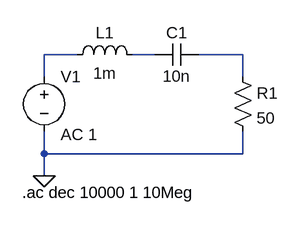
[diagram p0: schematic Circuito6.asc]
Circuito6.asc, the LTspice schematic file:
Version 4
SHEET 1 880 680
WIRE 48 112 0 112
WIRE 160 112 128 112
WIRE 288 112 224 112
WIRE 0 144 0 112
WIRE 288 144 288 112
WIRE 0 256 0 224
WIRE 288 256 288 224
WIRE 288 256 0 256
WIRE 0 288 0 256
FLAG 0 288 0
SYMBOL voltage 0 128 R0
WINDOW 123 24 100 Left 2
WINDOW 39 0 0 Left 0
SYMATTR InstName V1
SYMATTR Value ""
SYMATTR Value2 AC 1
SYMBOL ind 32 128 R270
WINDOW 0 32 56 VTop 2
WINDOW 3 5 56 VBottom 2
SYMATTR InstName L1
SYMATTR Value 1m
SYMBOL cap 160 128 R270
WINDOW 0 32 32 VTop 2
WINDOW 3 0 32 VBottom 2
SYMATTR InstName C1
SYMATTR Value 10n
SYMBOL res 272 128 R0
SYMATTR InstName R1
SYMATTR Value 50
TEXT -32 312 Left 2 !.ac dec 10000 1 10Meg

The netlist it stands for:
* Circuito6.asc
V1 N001 0 AC 1
L1 N001 N002 1m
C1 N002 N003 10n
R1 N003 0 50
.ac dec 10000 1 10Meg
.backanno
.end